# EasyEDA schematic schematic_easyeda.json
TITLE: Sheet_1; REV: 1.0; Date: 2026-01-20; Sheet: 1/1; Drawn By: huyngn1029; Company: Your Company
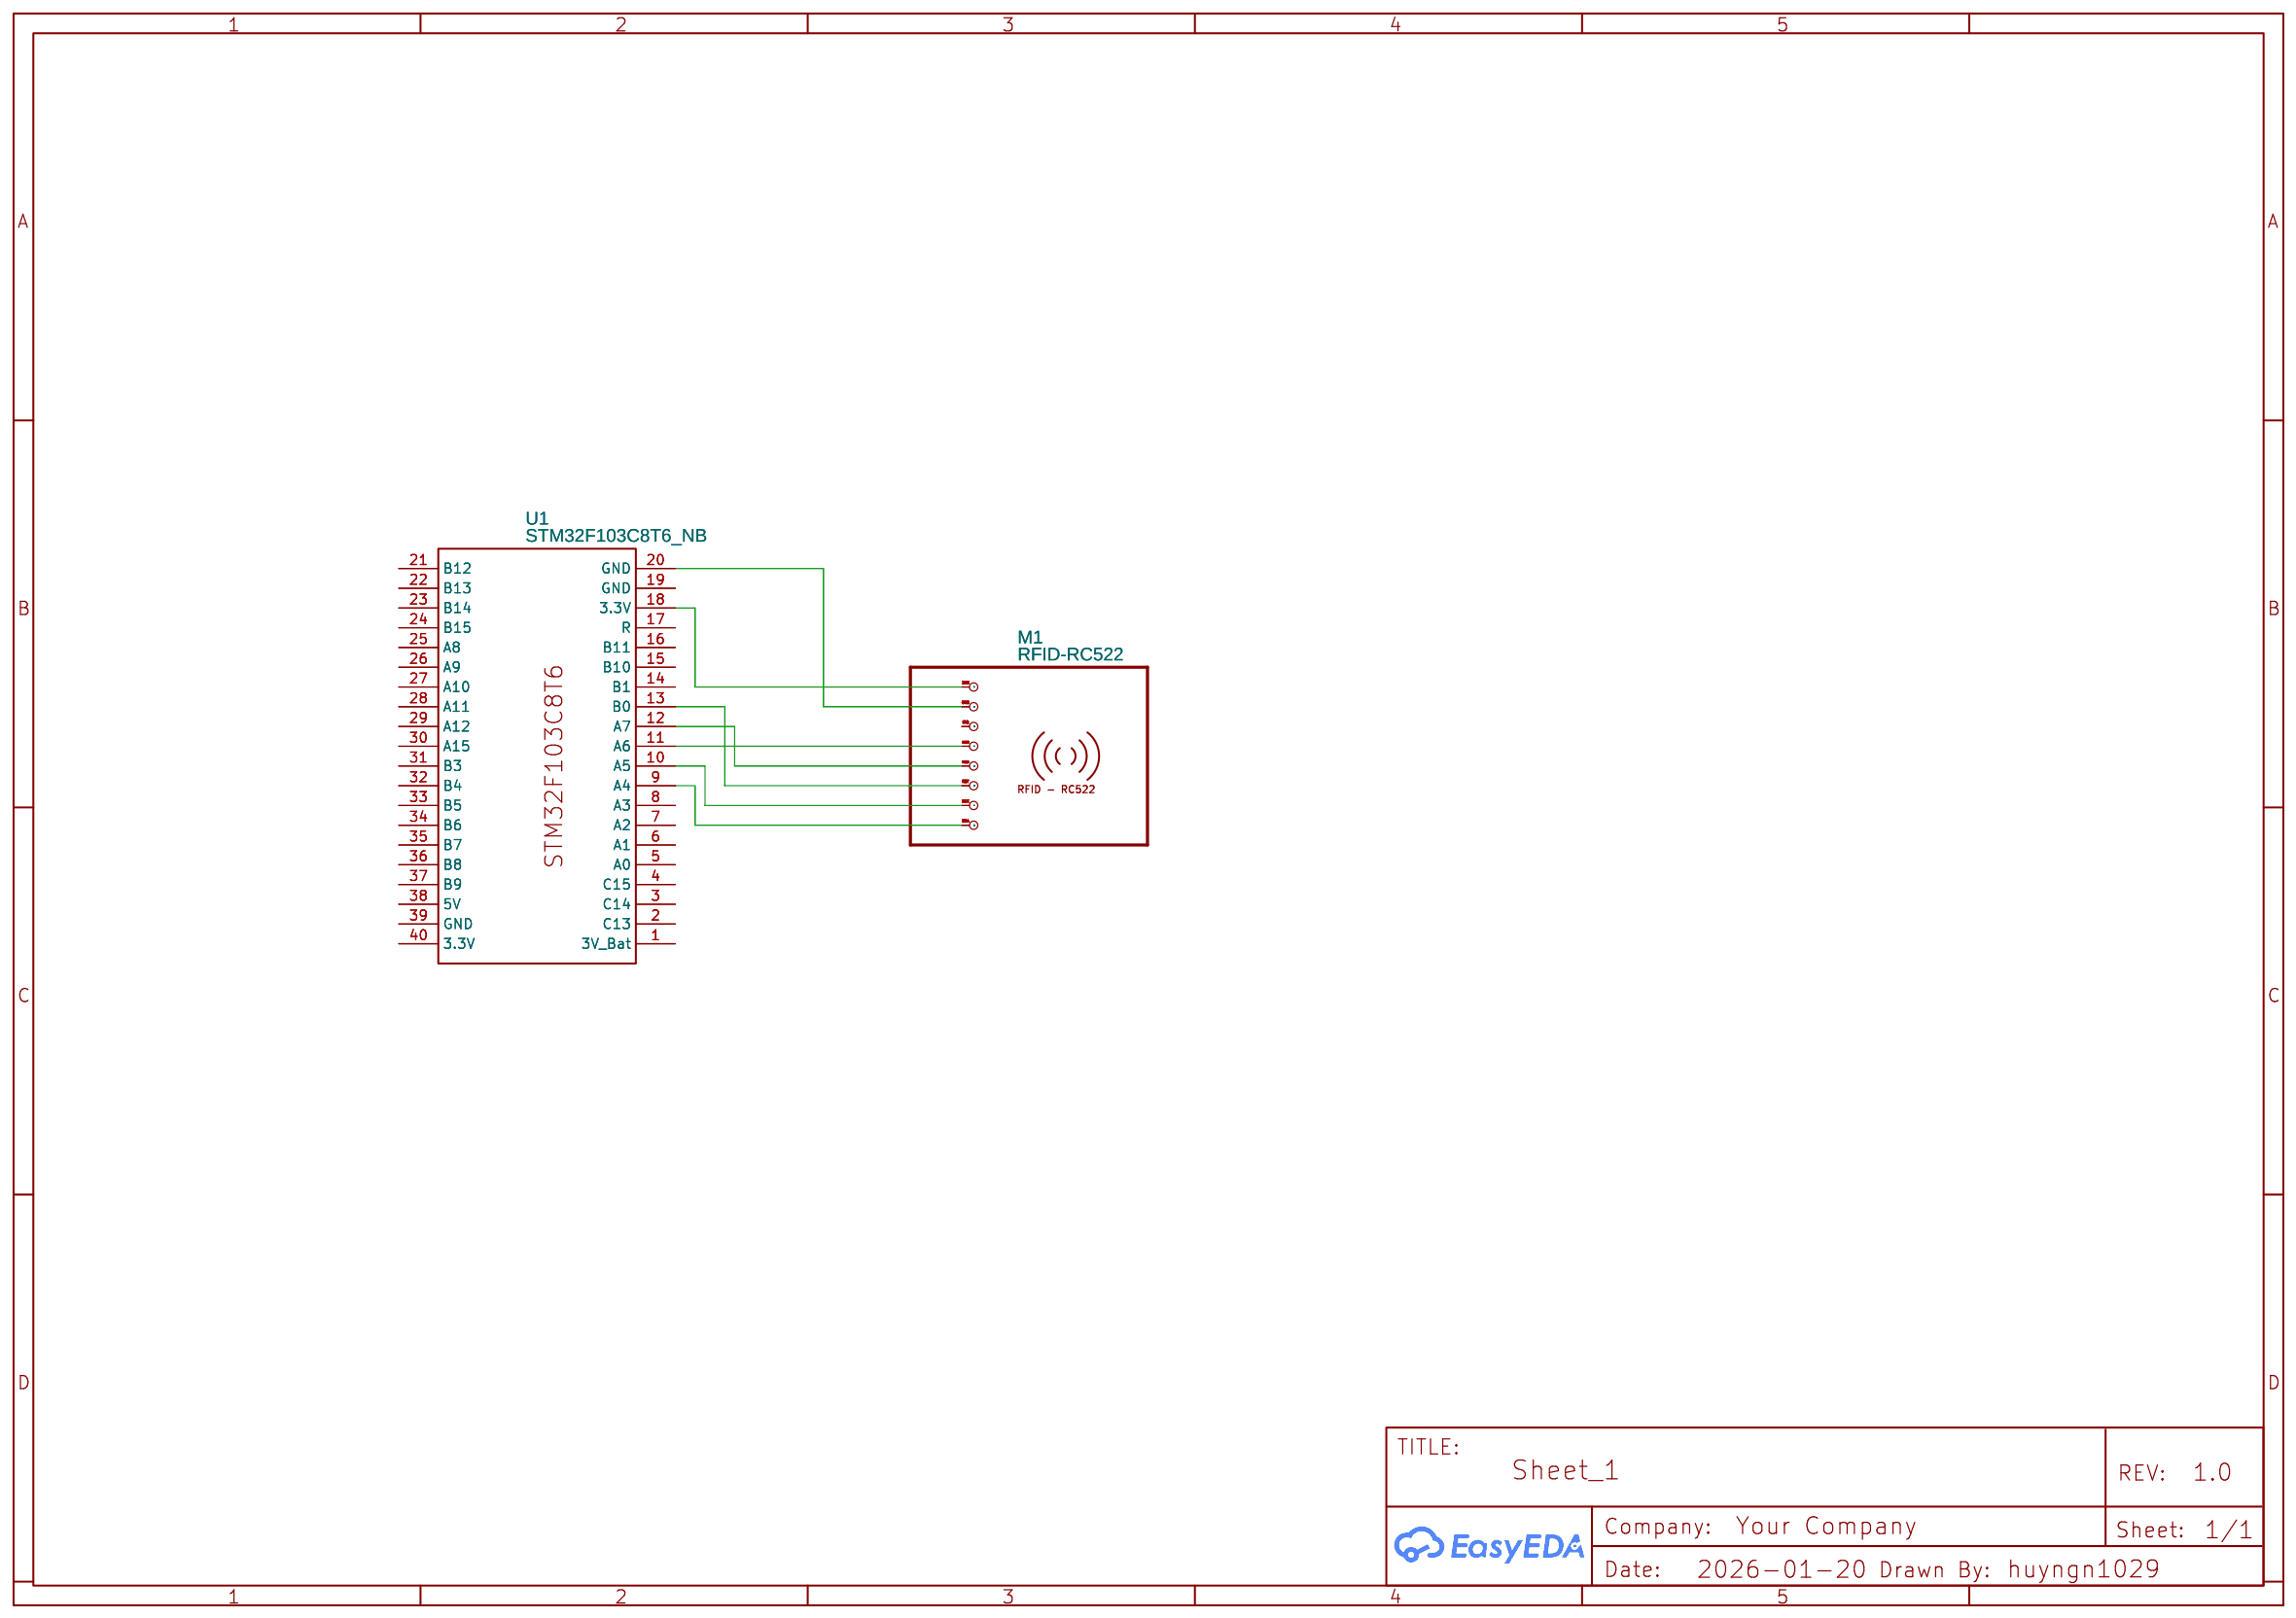
[diagram p0: schematic sheet]

## Parts
M1  RFID-RC522  [RFID-RC522]
U1  STM32F103C8T6_NB  [STM32F103C8T6_NB]

## Library data of the parts
M1 = RFID-RC522: Contributor: immanuelaprilio1
U1 = STM32F103C8T6_NB: Manufacturer Part: STM32F103C8T6; Contributor: junlakan67

## Nets
Net-(M1-3V3): M1.3V3(1) U1.18(3.3V)
Net-(M1-GND): M1.GND(2) U1.20(GND)
Net-(M1-MISO): M1.MISO(4) U1.11(A6)
Net-(M1-MOSI): M1.MOSI(5) U1.12(A7)
Net-(M1-RST): M1.RST(6) U1.13(B0)
Net-(M1-SCK): M1.SCK(7) U1.10(A5)
Net-(M1-SDA): M1.SDA(8) U1.9(A4)

Not connected (* = marked no-connect by the designer): M1 IRQ(3); U1 1(3V_Bat) 2(C13) 3(C14) 4(C15) 5(A0) 6(A1) 7(A2) 8(A3) 14(B1) 15(B10) 16(B11) 17(R) 19(GND) 21(B12) 22(B13) 23(B14) 24(B15) 25(A8) 26(A9) 27(A10) 28(A11) 29(A12) 30(A15) 31(B3) 32(B4) 33(B5) 34(B6) 35(B7) 36(B8) 37(B9) 38(5V) 39(GND) 40(3.3V)
